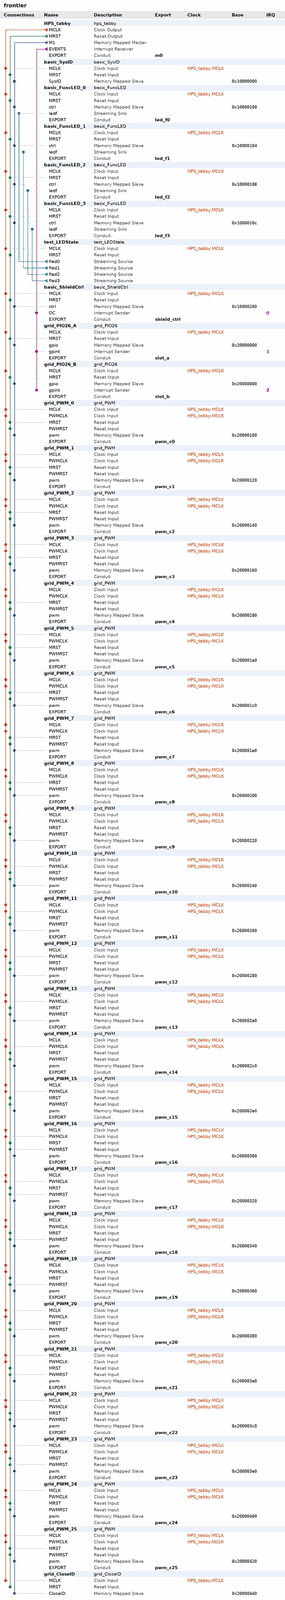
[diagram p0: system contents, whole]
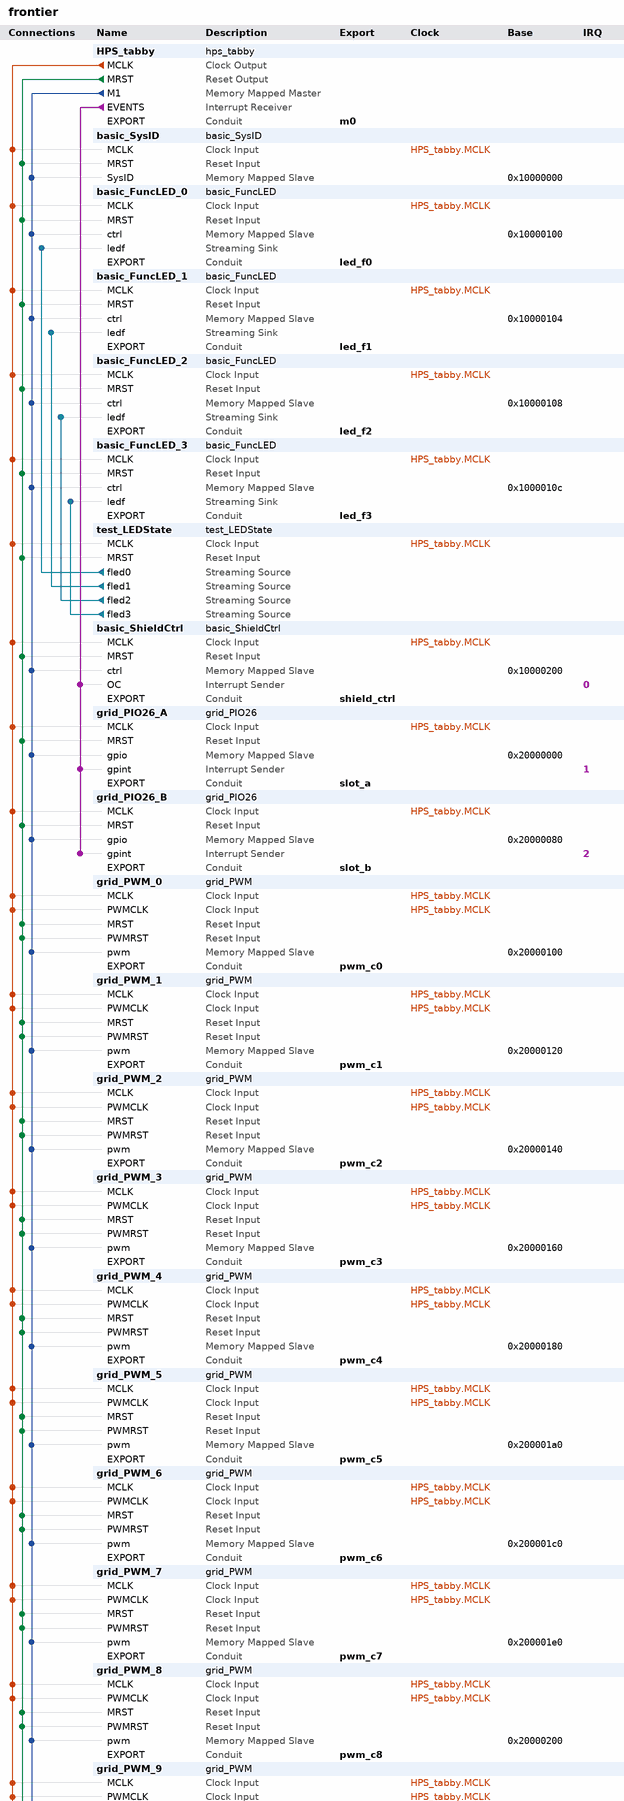
[diagram p1: system contents, upper part]
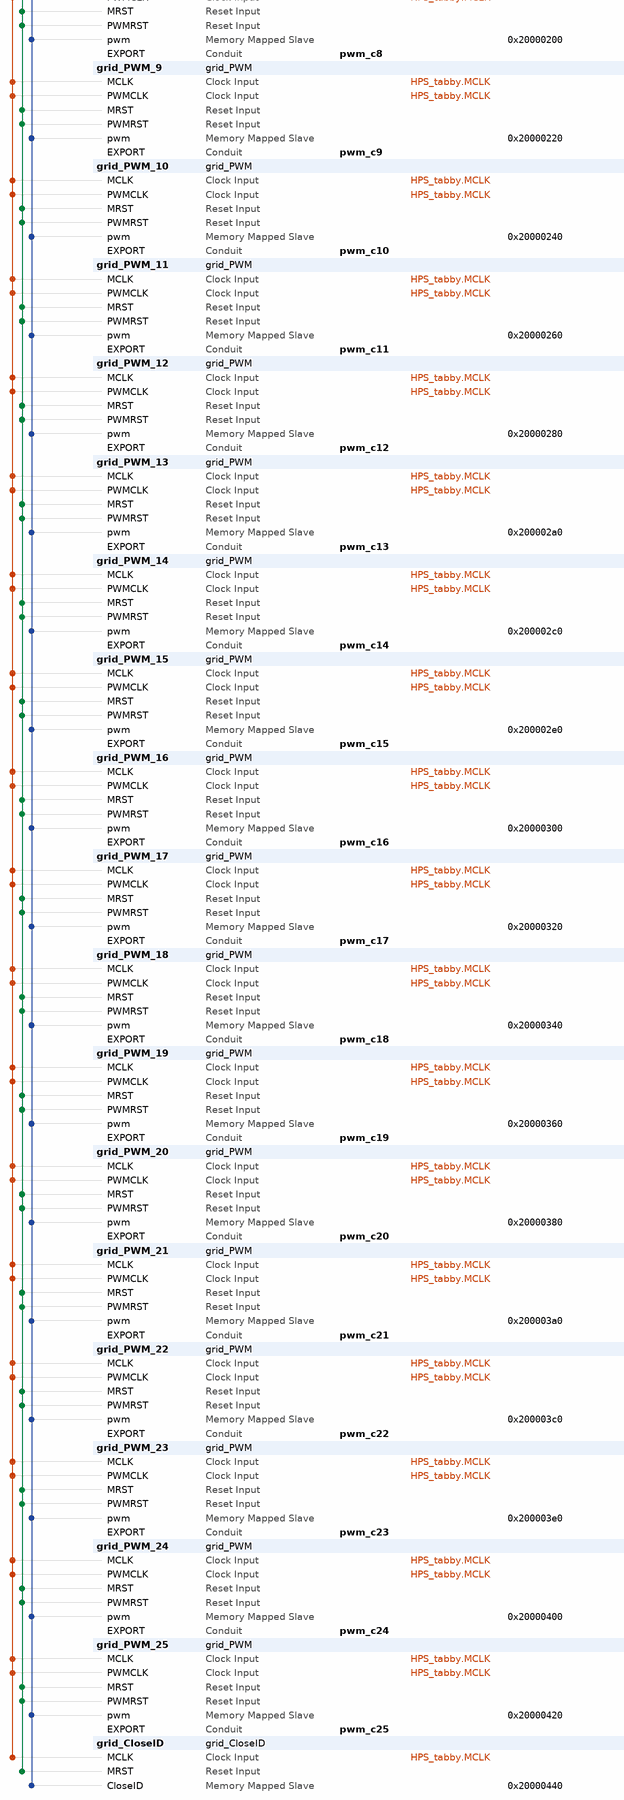
[diagram p2: system contents, lower part]
# Platform Designer (Qsys) system frontier, CYCLONEIVE EP4CE15F23C8
# Parameters at their usual value, and those the tool derives, are not listed.
package require qsys
create_system frontier
set_project_property DEVICE_FAMILY CYCLONEIVE
set_project_property DEVICE EP4CE15F23C8

add_instance HPS_tabby hps_tabby 1.1

add_instance basic_SysID basic_SysID 1.0

add_instance basic_FuncLED_0 basic_FuncLED 1.0

add_instance basic_FuncLED_1 basic_FuncLED 1.0

add_instance basic_FuncLED_2 basic_FuncLED 1.0

add_instance basic_FuncLED_3 basic_FuncLED 1.0

add_instance test_LEDState test_LEDState 1.0

add_instance basic_ShieldCtrl basic_ShieldCtrl 1.0

add_instance grid_PIO26_A grid_PIO26 1.0

add_instance grid_PIO26_B grid_PIO26 1.0

add_instance grid_PWM_0 grid_PWM 1.0

add_instance grid_PWM_1 grid_PWM 1.0

add_instance grid_PWM_2 grid_PWM 1.0

add_instance grid_PWM_3 grid_PWM 1.0

add_instance grid_PWM_4 grid_PWM 1.0

add_instance grid_PWM_5 grid_PWM 1.0

add_instance grid_PWM_6 grid_PWM 1.0

add_instance grid_PWM_7 grid_PWM 1.0

add_instance grid_PWM_8 grid_PWM 1.0

add_instance grid_PWM_9 grid_PWM 1.0

add_instance grid_PWM_10 grid_PWM 1.0

add_instance grid_PWM_11 grid_PWM 1.0

add_instance grid_PWM_12 grid_PWM 1.0

add_instance grid_PWM_13 grid_PWM 1.0

add_instance grid_PWM_14 grid_PWM 1.0

add_instance grid_PWM_15 grid_PWM 1.0

add_instance grid_PWM_16 grid_PWM 1.0

add_instance grid_PWM_17 grid_PWM 1.0

add_instance grid_PWM_18 grid_PWM 1.0

add_instance grid_PWM_19 grid_PWM 1.0

add_instance grid_PWM_20 grid_PWM 1.0

add_instance grid_PWM_21 grid_PWM 1.0

add_instance grid_PWM_22 grid_PWM 1.0

add_instance grid_PWM_23 grid_PWM 1.0

add_instance grid_PWM_24 grid_PWM 1.0

add_instance grid_PWM_25 grid_PWM 1.0

add_instance grid_CloseID grid_CloseID 1.1

# connections
add_connection HPS_tabby.MCLK basic_FuncLED_0.MCLK clock
add_connection HPS_tabby.MCLK basic_FuncLED_1.MCLK clock
add_connection HPS_tabby.MCLK basic_FuncLED_2.MCLK clock
add_connection HPS_tabby.MCLK basic_FuncLED_3.MCLK clock
add_connection HPS_tabby.MCLK basic_ShieldCtrl.MCLK clock
add_connection HPS_tabby.MCLK basic_SysID.MCLK clock
add_connection HPS_tabby.MCLK grid_CloseID.MCLK clock
add_connection HPS_tabby.MCLK grid_PIO26_A.MCLK clock
add_connection HPS_tabby.MCLK grid_PIO26_B.MCLK clock
add_connection HPS_tabby.MCLK grid_PWM_0.MCLK clock
add_connection HPS_tabby.MCLK grid_PWM_0.PWMCLK clock
add_connection HPS_tabby.MCLK grid_PWM_1.MCLK clock
add_connection HPS_tabby.MCLK grid_PWM_1.PWMCLK clock
add_connection HPS_tabby.MCLK grid_PWM_2.MCLK clock
add_connection HPS_tabby.MCLK grid_PWM_2.PWMCLK clock
add_connection HPS_tabby.MCLK grid_PWM_3.MCLK clock
add_connection HPS_tabby.MCLK grid_PWM_3.PWMCLK clock
add_connection HPS_tabby.MCLK grid_PWM_4.MCLK clock
add_connection HPS_tabby.MCLK grid_PWM_4.PWMCLK clock
add_connection HPS_tabby.MCLK grid_PWM_5.MCLK clock
add_connection HPS_tabby.MCLK grid_PWM_5.PWMCLK clock
add_connection HPS_tabby.MCLK grid_PWM_6.MCLK clock
add_connection HPS_tabby.MCLK grid_PWM_6.PWMCLK clock
add_connection HPS_tabby.MCLK grid_PWM_7.MCLK clock
add_connection HPS_tabby.MCLK grid_PWM_7.PWMCLK clock
add_connection HPS_tabby.MCLK grid_PWM_8.MCLK clock
add_connection HPS_tabby.MCLK grid_PWM_8.PWMCLK clock
add_connection HPS_tabby.MCLK grid_PWM_9.MCLK clock
add_connection HPS_tabby.MCLK grid_PWM_9.PWMCLK clock
add_connection HPS_tabby.MCLK grid_PWM_10.MCLK clock
add_connection HPS_tabby.MCLK grid_PWM_10.PWMCLK clock
add_connection HPS_tabby.MCLK grid_PWM_11.MCLK clock
add_connection HPS_tabby.MCLK grid_PWM_11.PWMCLK clock
add_connection HPS_tabby.MCLK grid_PWM_12.MCLK clock
add_connection HPS_tabby.MCLK grid_PWM_12.PWMCLK clock
add_connection HPS_tabby.MCLK grid_PWM_13.MCLK clock
add_connection HPS_tabby.MCLK grid_PWM_13.PWMCLK clock
add_connection HPS_tabby.MCLK grid_PWM_14.MCLK clock
add_connection HPS_tabby.MCLK grid_PWM_14.PWMCLK clock
add_connection HPS_tabby.MCLK grid_PWM_15.MCLK clock
add_connection HPS_tabby.MCLK grid_PWM_15.PWMCLK clock
add_connection HPS_tabby.MCLK grid_PWM_16.MCLK clock
add_connection HPS_tabby.MCLK grid_PWM_16.PWMCLK clock
add_connection HPS_tabby.MCLK grid_PWM_17.MCLK clock
add_connection HPS_tabby.MCLK grid_PWM_17.PWMCLK clock
add_connection HPS_tabby.MCLK grid_PWM_18.MCLK clock
add_connection HPS_tabby.MCLK grid_PWM_18.PWMCLK clock
add_connection HPS_tabby.MCLK grid_PWM_19.MCLK clock
add_connection HPS_tabby.MCLK grid_PWM_19.PWMCLK clock
add_connection HPS_tabby.MCLK grid_PWM_20.MCLK clock
add_connection HPS_tabby.MCLK grid_PWM_20.PWMCLK clock
add_connection HPS_tabby.MCLK grid_PWM_21.MCLK clock
add_connection HPS_tabby.MCLK grid_PWM_21.PWMCLK clock
add_connection HPS_tabby.MCLK grid_PWM_22.MCLK clock
add_connection HPS_tabby.MCLK grid_PWM_22.PWMCLK clock
add_connection HPS_tabby.MCLK grid_PWM_23.MCLK clock
add_connection HPS_tabby.MCLK grid_PWM_23.PWMCLK clock
add_connection HPS_tabby.MCLK grid_PWM_24.MCLK clock
add_connection HPS_tabby.MCLK grid_PWM_24.PWMCLK clock
add_connection HPS_tabby.MCLK grid_PWM_25.MCLK clock
add_connection HPS_tabby.MCLK grid_PWM_25.PWMCLK clock
add_connection HPS_tabby.MCLK test_LEDState.MCLK clock
add_connection HPS_tabby.MRST basic_FuncLED_0.MRST reset
add_connection HPS_tabby.MRST basic_FuncLED_1.MRST reset
add_connection HPS_tabby.MRST basic_FuncLED_2.MRST reset
add_connection HPS_tabby.MRST basic_FuncLED_3.MRST reset
add_connection HPS_tabby.MRST basic_ShieldCtrl.MRST reset
add_connection HPS_tabby.MRST basic_SysID.MRST reset
add_connection HPS_tabby.MRST grid_CloseID.MRST reset
add_connection HPS_tabby.MRST grid_PIO26_A.MRST reset
add_connection HPS_tabby.MRST grid_PIO26_B.MRST reset
add_connection HPS_tabby.MRST grid_PWM_0.MRST reset
add_connection HPS_tabby.MRST grid_PWM_0.PWMRST reset
add_connection HPS_tabby.MRST grid_PWM_1.MRST reset
add_connection HPS_tabby.MRST grid_PWM_1.PWMRST reset
add_connection HPS_tabby.MRST grid_PWM_2.MRST reset
add_connection HPS_tabby.MRST grid_PWM_2.PWMRST reset
add_connection HPS_tabby.MRST grid_PWM_3.MRST reset
add_connection HPS_tabby.MRST grid_PWM_3.PWMRST reset
add_connection HPS_tabby.MRST grid_PWM_4.MRST reset
add_connection HPS_tabby.MRST grid_PWM_4.PWMRST reset
add_connection HPS_tabby.MRST grid_PWM_5.MRST reset
add_connection HPS_tabby.MRST grid_PWM_5.PWMRST reset
add_connection HPS_tabby.MRST grid_PWM_6.MRST reset
add_connection HPS_tabby.MRST grid_PWM_6.PWMRST reset
add_connection HPS_tabby.MRST grid_PWM_7.MRST reset
add_connection HPS_tabby.MRST grid_PWM_7.PWMRST reset
add_connection HPS_tabby.MRST grid_PWM_8.MRST reset
add_connection HPS_tabby.MRST grid_PWM_8.PWMRST reset
add_connection HPS_tabby.MRST grid_PWM_9.MRST reset
add_connection HPS_tabby.MRST grid_PWM_9.PWMRST reset
add_connection HPS_tabby.MRST grid_PWM_10.MRST reset
add_connection HPS_tabby.MRST grid_PWM_10.PWMRST reset
add_connection HPS_tabby.MRST grid_PWM_11.MRST reset
add_connection HPS_tabby.MRST grid_PWM_11.PWMRST reset
add_connection HPS_tabby.MRST grid_PWM_12.MRST reset
add_connection HPS_tabby.MRST grid_PWM_12.PWMRST reset
add_connection HPS_tabby.MRST grid_PWM_13.MRST reset
add_connection HPS_tabby.MRST grid_PWM_13.PWMRST reset
add_connection HPS_tabby.MRST grid_PWM_14.MRST reset
add_connection HPS_tabby.MRST grid_PWM_14.PWMRST reset
add_connection HPS_tabby.MRST grid_PWM_15.MRST reset
add_connection HPS_tabby.MRST grid_PWM_15.PWMRST reset
add_connection HPS_tabby.MRST grid_PWM_16.MRST reset
add_connection HPS_tabby.MRST grid_PWM_16.PWMRST reset
add_connection HPS_tabby.MRST grid_PWM_17.MRST reset
add_connection HPS_tabby.MRST grid_PWM_17.PWMRST reset
add_connection HPS_tabby.MRST grid_PWM_18.MRST reset
add_connection HPS_tabby.MRST grid_PWM_18.PWMRST reset
add_connection HPS_tabby.MRST grid_PWM_19.MRST reset
add_connection HPS_tabby.MRST grid_PWM_19.PWMRST reset
add_connection HPS_tabby.MRST grid_PWM_20.MRST reset
add_connection HPS_tabby.MRST grid_PWM_20.PWMRST reset
add_connection HPS_tabby.MRST grid_PWM_21.MRST reset
add_connection HPS_tabby.MRST grid_PWM_21.PWMRST reset
add_connection HPS_tabby.MRST grid_PWM_22.MRST reset
add_connection HPS_tabby.MRST grid_PWM_22.PWMRST reset
add_connection HPS_tabby.MRST grid_PWM_23.MRST reset
add_connection HPS_tabby.MRST grid_PWM_23.PWMRST reset
add_connection HPS_tabby.MRST grid_PWM_24.MRST reset
add_connection HPS_tabby.MRST grid_PWM_24.PWMRST reset
add_connection HPS_tabby.MRST grid_PWM_25.MRST reset
add_connection HPS_tabby.MRST grid_PWM_25.PWMRST reset
add_connection HPS_tabby.MRST test_LEDState.MRST reset
add_connection HPS_tabby.M1 basic_FuncLED_0.ctrl avalon
set_connection_parameter_value HPS_tabby.M1/basic_FuncLED_0.ctrl baseAddress 0x10000100
add_connection HPS_tabby.M1 basic_FuncLED_1.ctrl avalon
set_connection_parameter_value HPS_tabby.M1/basic_FuncLED_1.ctrl baseAddress 0x10000104
add_connection HPS_tabby.M1 basic_FuncLED_2.ctrl avalon
set_connection_parameter_value HPS_tabby.M1/basic_FuncLED_2.ctrl baseAddress 0x10000108
add_connection HPS_tabby.M1 basic_FuncLED_3.ctrl avalon
set_connection_parameter_value HPS_tabby.M1/basic_FuncLED_3.ctrl baseAddress 0x1000010c
add_connection HPS_tabby.M1 basic_ShieldCtrl.ctrl avalon
set_connection_parameter_value HPS_tabby.M1/basic_ShieldCtrl.ctrl baseAddress 0x10000200
add_connection HPS_tabby.M1 basic_SysID.SysID avalon
set_connection_parameter_value HPS_tabby.M1/basic_SysID.SysID baseAddress 0x10000000
add_connection HPS_tabby.M1 grid_CloseID.CloseID avalon
set_connection_parameter_value HPS_tabby.M1/grid_CloseID.CloseID baseAddress 0x20000440
add_connection HPS_tabby.M1 grid_PIO26_A.gpio avalon
set_connection_parameter_value HPS_tabby.M1/grid_PIO26_A.gpio baseAddress 0x20000000
add_connection HPS_tabby.M1 grid_PIO26_B.gpio avalon
set_connection_parameter_value HPS_tabby.M1/grid_PIO26_B.gpio baseAddress 0x20000080
add_connection HPS_tabby.M1 grid_PWM_0.pwm avalon
set_connection_parameter_value HPS_tabby.M1/grid_PWM_0.pwm baseAddress 0x20000100
add_connection HPS_tabby.M1 grid_PWM_1.pwm avalon
set_connection_parameter_value HPS_tabby.M1/grid_PWM_1.pwm baseAddress 0x20000120
add_connection HPS_tabby.M1 grid_PWM_2.pwm avalon
set_connection_parameter_value HPS_tabby.M1/grid_PWM_2.pwm baseAddress 0x20000140
add_connection HPS_tabby.M1 grid_PWM_3.pwm avalon
set_connection_parameter_value HPS_tabby.M1/grid_PWM_3.pwm baseAddress 0x20000160
add_connection HPS_tabby.M1 grid_PWM_4.pwm avalon
set_connection_parameter_value HPS_tabby.M1/grid_PWM_4.pwm baseAddress 0x20000180
add_connection HPS_tabby.M1 grid_PWM_5.pwm avalon
set_connection_parameter_value HPS_tabby.M1/grid_PWM_5.pwm baseAddress 0x200001a0
add_connection HPS_tabby.M1 grid_PWM_6.pwm avalon
set_connection_parameter_value HPS_tabby.M1/grid_PWM_6.pwm baseAddress 0x200001c0
add_connection HPS_tabby.M1 grid_PWM_7.pwm avalon
set_connection_parameter_value HPS_tabby.M1/grid_PWM_7.pwm baseAddress 0x200001e0
add_connection HPS_tabby.M1 grid_PWM_8.pwm avalon
set_connection_parameter_value HPS_tabby.M1/grid_PWM_8.pwm baseAddress 0x20000200
add_connection HPS_tabby.M1 grid_PWM_9.pwm avalon
set_connection_parameter_value HPS_tabby.M1/grid_PWM_9.pwm baseAddress 0x20000220
add_connection HPS_tabby.M1 grid_PWM_10.pwm avalon
set_connection_parameter_value HPS_tabby.M1/grid_PWM_10.pwm baseAddress 0x20000240
add_connection HPS_tabby.M1 grid_PWM_11.pwm avalon
set_connection_parameter_value HPS_tabby.M1/grid_PWM_11.pwm baseAddress 0x20000260
add_connection HPS_tabby.M1 grid_PWM_12.pwm avalon
set_connection_parameter_value HPS_tabby.M1/grid_PWM_12.pwm baseAddress 0x20000280
add_connection HPS_tabby.M1 grid_PWM_13.pwm avalon
set_connection_parameter_value HPS_tabby.M1/grid_PWM_13.pwm baseAddress 0x200002a0
add_connection HPS_tabby.M1 grid_PWM_14.pwm avalon
set_connection_parameter_value HPS_tabby.M1/grid_PWM_14.pwm baseAddress 0x200002c0
add_connection HPS_tabby.M1 grid_PWM_15.pwm avalon
set_connection_parameter_value HPS_tabby.M1/grid_PWM_15.pwm baseAddress 0x200002e0
add_connection HPS_tabby.M1 grid_PWM_16.pwm avalon
set_connection_parameter_value HPS_tabby.M1/grid_PWM_16.pwm baseAddress 0x20000300
add_connection HPS_tabby.M1 grid_PWM_17.pwm avalon
set_connection_parameter_value HPS_tabby.M1/grid_PWM_17.pwm baseAddress 0x20000320
add_connection HPS_tabby.M1 grid_PWM_18.pwm avalon
set_connection_parameter_value HPS_tabby.M1/grid_PWM_18.pwm baseAddress 0x20000340
add_connection HPS_tabby.M1 grid_PWM_19.pwm avalon
set_connection_parameter_value HPS_tabby.M1/grid_PWM_19.pwm baseAddress 0x20000360
add_connection HPS_tabby.M1 grid_PWM_20.pwm avalon
set_connection_parameter_value HPS_tabby.M1/grid_PWM_20.pwm baseAddress 0x20000380
add_connection HPS_tabby.M1 grid_PWM_21.pwm avalon
set_connection_parameter_value HPS_tabby.M1/grid_PWM_21.pwm baseAddress 0x200003a0
add_connection HPS_tabby.M1 grid_PWM_22.pwm avalon
set_connection_parameter_value HPS_tabby.M1/grid_PWM_22.pwm baseAddress 0x200003c0
add_connection HPS_tabby.M1 grid_PWM_23.pwm avalon
set_connection_parameter_value HPS_tabby.M1/grid_PWM_23.pwm baseAddress 0x200003e0
add_connection HPS_tabby.M1 grid_PWM_24.pwm avalon
set_connection_parameter_value HPS_tabby.M1/grid_PWM_24.pwm baseAddress 0x20000400
add_connection HPS_tabby.M1 grid_PWM_25.pwm avalon
set_connection_parameter_value HPS_tabby.M1/grid_PWM_25.pwm baseAddress 0x20000420
add_connection test_LEDState.fled0 basic_FuncLED_0.ledf avalon_streaming
add_connection test_LEDState.fled1 basic_FuncLED_1.ledf avalon_streaming
add_connection test_LEDState.fled2 basic_FuncLED_2.ledf avalon_streaming
add_connection test_LEDState.fled3 basic_FuncLED_3.ledf avalon_streaming
add_connection HPS_tabby.EVENTS basic_ShieldCtrl.OC interrupt
set_connection_parameter_value HPS_tabby.EVENTS/basic_ShieldCtrl.OC irqNumber 0
add_connection HPS_tabby.EVENTS grid_PIO26_A.gpint interrupt
set_connection_parameter_value HPS_tabby.EVENTS/grid_PIO26_A.gpint irqNumber 1
add_connection HPS_tabby.EVENTS grid_PIO26_B.gpint interrupt
set_connection_parameter_value HPS_tabby.EVENTS/grid_PIO26_B.gpint irqNumber 2

# exported interfaces
add_interface m0 conduit end
set_interface_property m0 EXPORT_OF HPS_tabby.EXPORT
add_interface led_f0 conduit end
set_interface_property led_f0 EXPORT_OF basic_FuncLED_0.EXPORT
add_interface led_f1 conduit end
set_interface_property led_f1 EXPORT_OF basic_FuncLED_1.EXPORT
add_interface led_f2 conduit end
set_interface_property led_f2 EXPORT_OF basic_FuncLED_2.EXPORT
add_interface led_f3 conduit end
set_interface_property led_f3 EXPORT_OF basic_FuncLED_3.EXPORT
add_interface shield_ctrl conduit end
set_interface_property shield_ctrl EXPORT_OF basic_ShieldCtrl.EXPORT
add_interface slot_a conduit end
set_interface_property slot_a EXPORT_OF grid_PIO26_A.EXPORT
add_interface slot_b conduit end
set_interface_property slot_b EXPORT_OF grid_PIO26_B.EXPORT
add_interface pwm_c0 conduit end
set_interface_property pwm_c0 EXPORT_OF grid_PWM_0.EXPORT
add_interface pwm_c1 conduit end
set_interface_property pwm_c1 EXPORT_OF grid_PWM_1.EXPORT
add_interface pwm_c2 conduit end
set_interface_property pwm_c2 EXPORT_OF grid_PWM_2.EXPORT
add_interface pwm_c3 conduit end
set_interface_property pwm_c3 EXPORT_OF grid_PWM_3.EXPORT
add_interface pwm_c4 conduit end
set_interface_property pwm_c4 EXPORT_OF grid_PWM_4.EXPORT
add_interface pwm_c5 conduit end
set_interface_property pwm_c5 EXPORT_OF grid_PWM_5.EXPORT
add_interface pwm_c6 conduit end
set_interface_property pwm_c6 EXPORT_OF grid_PWM_6.EXPORT
add_interface pwm_c7 conduit end
set_interface_property pwm_c7 EXPORT_OF grid_PWM_7.EXPORT
add_interface pwm_c8 conduit end
set_interface_property pwm_c8 EXPORT_OF grid_PWM_8.EXPORT
add_interface pwm_c9 conduit end
set_interface_property pwm_c9 EXPORT_OF grid_PWM_9.EXPORT
add_interface pwm_c10 conduit end
set_interface_property pwm_c10 EXPORT_OF grid_PWM_10.EXPORT
add_interface pwm_c11 conduit end
set_interface_property pwm_c11 EXPORT_OF grid_PWM_11.EXPORT
add_interface pwm_c12 conduit end
set_interface_property pwm_c12 EXPORT_OF grid_PWM_12.EXPORT
add_interface pwm_c13 conduit end
set_interface_property pwm_c13 EXPORT_OF grid_PWM_13.EXPORT
add_interface pwm_c14 conduit end
set_interface_property pwm_c14 EXPORT_OF grid_PWM_14.EXPORT
add_interface pwm_c15 conduit end
set_interface_property pwm_c15 EXPORT_OF grid_PWM_15.EXPORT
add_interface pwm_c16 conduit end
set_interface_property pwm_c16 EXPORT_OF grid_PWM_16.EXPORT
add_interface pwm_c17 conduit end
set_interface_property pwm_c17 EXPORT_OF grid_PWM_17.EXPORT
add_interface pwm_c18 conduit end
set_interface_property pwm_c18 EXPORT_OF grid_PWM_18.EXPORT
add_interface pwm_c19 conduit end
set_interface_property pwm_c19 EXPORT_OF grid_PWM_19.EXPORT
add_interface pwm_c20 conduit end
set_interface_property pwm_c20 EXPORT_OF grid_PWM_20.EXPORT
add_interface pwm_c21 conduit end
set_interface_property pwm_c21 EXPORT_OF grid_PWM_21.EXPORT
add_interface pwm_c22 conduit end
set_interface_property pwm_c22 EXPORT_OF grid_PWM_22.EXPORT
add_interface pwm_c23 conduit end
set_interface_property pwm_c23 EXPORT_OF grid_PWM_23.EXPORT
add_interface pwm_c24 conduit end
set_interface_property pwm_c24 EXPORT_OF grid_PWM_24.EXPORT
add_interface pwm_c25 conduit end
set_interface_property pwm_c25 EXPORT_OF grid_PWM_25.EXPORT

save_system frontier.qsys
